# Altium schematic sheet Esquema.SchDoc: ARDU PROTOTYPE.    Gorka G. (part 3 of 3)
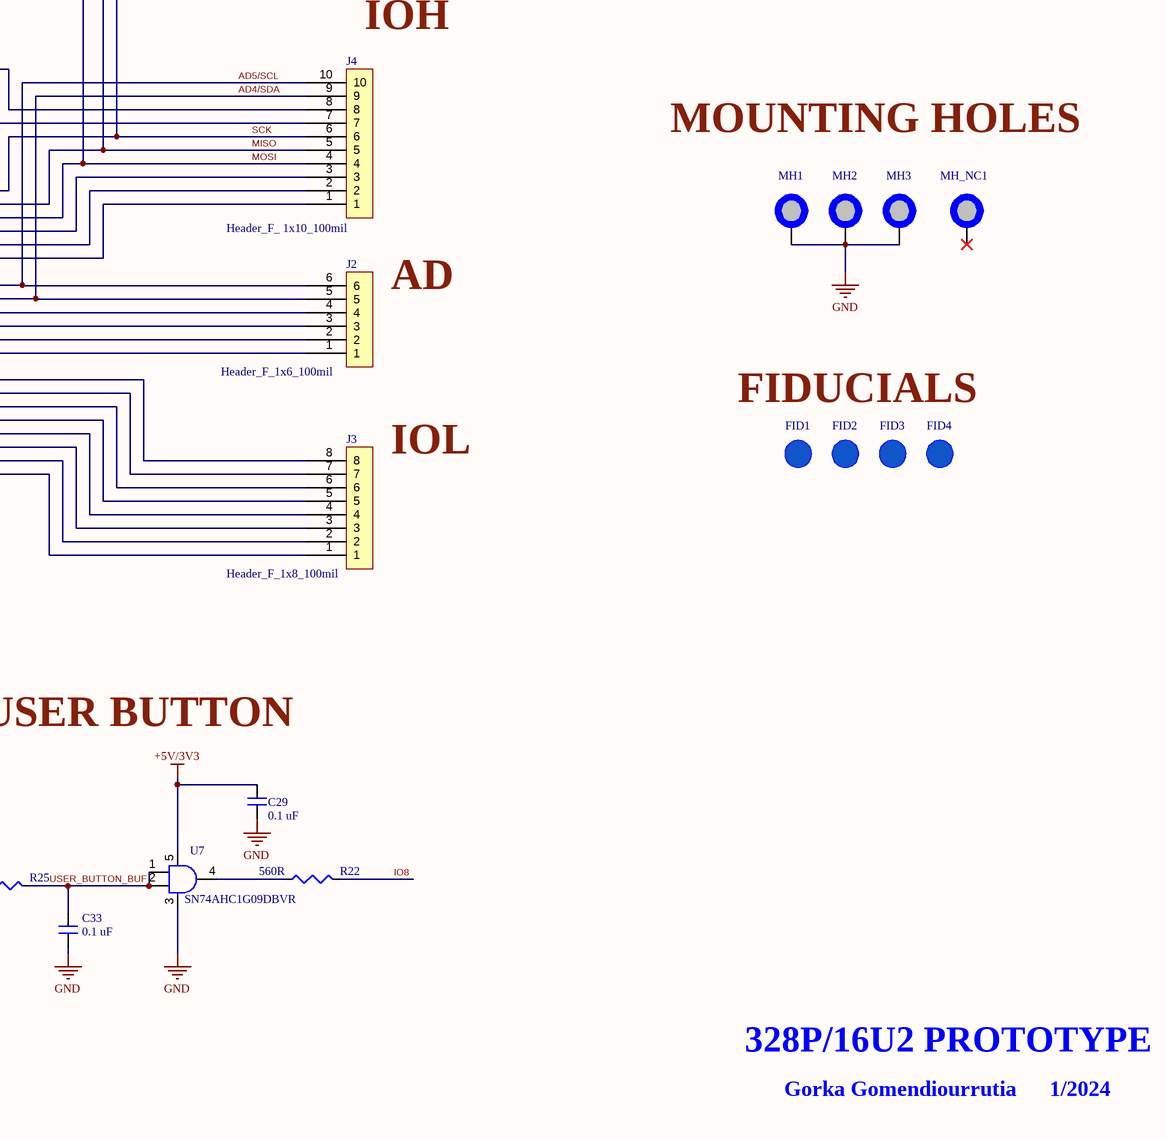
[diagram p5: Esquema.SchDoc, bottom right]

## Library data of the parts (continued)
U3 = TL1963A-33DCQR: LDO Regulator Pos 3.3V 1.5A 6-Pin(5+Tab) SOT-223 T/R; Manufacturer: Texas Instruments; Dropout Voltage: 340mV; Number of Outputs: 1; Max Input Voltage: 20V; Min Input Voltage: 2.1V; Min Current Limit: 1.6A; Input Bias Current: 1mA; Polarity: Positive; Accuracy: 3%; Output Type: Fixed; Supplier 1: Digikey; Manufacturer Part Number: TL1963A-33DCQR; RoHS: Yes; Category: Voltage Regulators - Linear; Stock 1: 9273; Pricing 1: 1=3,45, 10=3,098, 25=2,9292, 100=2,5387, 250=2,40848, 500=2,16114, 1000=1,82265 (USD); Case/Package: SOT-223-6; Number of Pins: 6; Min Operating Temperature: -40°C; Max Operating Temperature: 125°C; Package Quantity: 1; Packaging: Tape and Reel; Output Voltage: 3.3V; Output Current: 1.5A; Max Output Current: 1.5A; Number of Regulators: 1; Quiescent Current: 1mA; Max Output Voltage: 3.3V; Min Output Voltage: 3.3V; Series: -; Radiation Hardening: No; Lead Free: Lead Free; RoHS Compliant: Yes; ComponentLink1URL: https://datasheet.ciiva.com/2046/tl1963a-2046162.pdf?src-supplier=Digikey; ComponentLink1Description: https://datasheet.ciiva.com/2046/tl1963a-2046162.pdf?src-supplier=Digikey; ComponentLink2URL: https://datasheet.ciiva.com/2046/tl1963a-2046161.pdf?src-supplier=Digikey; ComponentLink2Description: https://datasheet.ciiva.com/2046/tl1963a-2046161.pdf?src-supplier=Digikey; ComponentLink3URL: https://datasheet.ciiva.com/2046/tl1963a-2046163.pdf?src-supplier=Digikey; ComponentLink3Description: https://datasheet.ciiva.com/2046/tl1963a-2046163.pdf?src-supplier=Digikey; Supplier Part Number 1: 296-24534-1-ND
U4-U7 = SN74AHC1G09DBVR: 1-ch, 2-input 2-V to 5.5-V high-speed (9 ns) AND gate with open-drain outputs 5-SOT-23 -55 to 125; Manufacturer: Texas Instruments; Min Supply Voltage: 2V; Max Supply Voltage: 5.5V; Quiescent Current: 1uA; Number of Inputs: 2; Propagation Delay: 7.5ns; Output Current: 25mA; Number of Circuits: 1; Low Level Output Current: 8mA; Number of Channels: 1NUMBER; Supplier 1: Digikey; Manufacturer Part Number: SN74AHC1G09DBVR; RoHS: Yes; Category: Logic Gates; Stock 1: 8311; Pricing 1: 1=0,36, 10=0,269, 25=0,2352, 100=0,1522, 250=0,126, 500=0,1008, 1000=0,07729 (USD); Mount: Surface Mount; Case/Package: SOT-23; Number of Pins: 5; Min Operating Temperature: -55°C; Max Operating Temperature: 125°C; Logic Function: AND GATE; Package Quantity: 3000; Packaging: Tape and Reel; Number of Gates: 1; Number of Elements: 1; Number of Bits: 1; Series: 74AHC; Technology: CMOS; Output Voltage: 5.5V; Number of Outputs: 1; Nominal Supply Current: 1uA; Length: 2.9mm; Width: 1.6mm; Height: 1.45mm; Thickness: 1.2mm; Radiation Hardening: No; Reach SVHC Compliant: No; Lead Free: Lead Free; RoHS Compliant: Yes; ComponentLink1URL: https://datasheet.ciiva.com/1864/sn74ahc1g09-1864411.pdf?src-supplier=Digikey; ComponentLink1Description: https://datasheet.ciiva.com/1864/sn74ahc1g09-1864411.pdf?src-supplier=Digikey; ComponentLink2URL: https://datasheet.ciiva.com/1864/sn74ahc1g09-1864410.pdf?src-supplier=Digikey; ComponentLink2Description: https://datasheet.ciiva.com/1864/sn74ahc1g09-1864410.pdf?src-supplier=Digikey; ComponentLink3URL: https://datasheet.ciiva.com/1864/sn74ahc1g09-1864412.pdf?src-supplier=Digikey; ComponentLink3Description: https://datasheet.ciiva.com/1864/sn74ahc1g09-1864412.pdf?src-supplier=Digikey; Supplier Part Number 1: 296-29202-1-ND
Y1 Y2 = ABM7-16.000MHZ-D2Y-T: Crystal 16MHz ±20ppm (Tol) ±30ppm (Stability) 18pF FUND 50Ohm 2-Pin Mini-CSMD T/R; Manufacturer: Abracon; Supplier 1: Digikey; Manufacturer Part Number: ABM7-16.000MHZ-D2Y-T; RoHS: Yes; Category: Crystals; Stock 1: 54717; Pricing 1: 1=0,67, 10=0,556, 50=0,5, 100=0,4444, 500=0,42218 (USD); ComponentLink1URL: https://datasheet.ciiva.com/15116/getdatasheetpartid-721624-15116835.pdf?src-supplier=Verical; ComponentLink1Description: https://datasheet.ciiva.com/15116/getdatasheetpartid-721624-15116835.pdf?src-supplier=Verical; ComponentLink2URL: https://datasheet.ciiva.com/16383/abm7-16383174.pdf?src-supplier=Future+Electronics; ComponentLink2Description: https://datasheet.ciiva.com/16383/abm7-16383174.pdf?src-supplier=Future+Electronics; ComponentLink3URL: https://datasheet.ciiva.com/7998/947971-7998600.pdf?src-supplier=Element14; ComponentLink3Description: https://datasheet.ciiva.com/7998/947971-7998600.pdf?src-supplier=Element14; ComponentLink4URL: https://datasheet.ciiva.com/46385/947971-46385243.pdf?src-supplier=Element14; ComponentLink4Description: https://datasheet.ciiva.com/46385/947971-46385243.pdf?src-supplier=Element14; ComponentLink5URL: https://datasheet.ciiva.com/22658/947971-22658293.pdf?src-supplier=Element14; ComponentLink5Description: https://datasheet.ciiva.com/22658/947971-22658293.pdf?src-supplier=Element14; ComponentLink6URL: https://datasheet.ciiva.com/26941/getdatasheetpartid-719818-26941724.pdf?src-supplier=Verical; ComponentLink6Description: https://datasheet.ciiva.com/26941/getdatasheetpartid-719818-26941724.pdf?src-supplier=Verical; ComponentLink7URL: https://datasheet.ciiva.com/18649/abm7-18649865.pdf?src-supplier=Digikey; ComponentLink7Description: https://datasheet.ciiva.com/18649/abm7-18649865.pdf?src-supplier=Digikey; ComponentLink8URL: https://datasheet.ciiva.com/18649/abm7-18649866.pdf?src-supplier=Digikey; ComponentLink8Description: https://datasheet.ciiva.com/18649/abm7-18649866.pdf?src-supplier=Digikey; ComponentLink9URL: https://datasheet.ciiva.com/18649/abm7-18649867.pdf?src-supplier=Digikey; ComponentLink9Description: https://datasheet.ciiva.com/18649/abm7-18649867.pdf?src-supplier=Digikey; ComponentLink10URL: https://datasheet.ciiva.com/5788/abm7-5788054.pdf?src-supplier=Farnell; ComponentLink10Description: https://datasheet.ciiva.com/5788/abm7-5788054.pdf?src-supplier=Farnell; Supplier Part Number 1: 535-9840-1-ND
Z1 Z2 = CG0603MLC-05E: ESD Suppressor Multilayer Varistor 5V Automotive 2-Pin Case 0603(1608Metric) T/R; Manufacturer: Bourns; Capacitance: 0.5pF; Voltage Rating (AC): 8V; Number of Channels: 1; Clamping Voltage: 20V; Current Rating: 50nA; Supplier 1: Digikey; Manufacturer Part Number: CG0603MLC-05E; RoHS: Yes; Category: Varistors; Stock 1: 173443; Pricing 1: 1=0,45, 10=0,336, 25=0,3032, 100=0,2096, 250=0,17648, 500=0,14338, 1000=0,11029, 2500=0,09926 (USD); Case/Package: 0603; Number of Pins: 2; Case Code (Imperial): 0603; Case Code (Metric): 1608; Contact Plating: Tin; Min Operating Temperature: -40°C; Max Operating Temperature: 85°C; Voltage Rating (DC): 5V; Operating Supply Voltage: 5V; Package Quantity: 1; Packaging: Tape and Reel; Termination: SMD/SMT; Voltage: 5V; Number of Circuits: 1; Max Voltage Rating (DC): 5V; Working Voltage: 5V; Leakage Current: 50nA; Series: MLC; Length: 1.6mm; Width: 0.8mm; Depth: 0.8mm; Thickness: 0.8mm; Radiation Hardening: No; Reach SVHC Compliant: No; RoHS Compliant: Yes; ComponentLink1URL: https://datasheet.ciiva.com/8084/mlc-8084047.pdf?src-supplier=Avnet; ComponentLink1Description: https://datasheet.ciiva.com/8084/mlc-8084047.pdf?src-supplier=Avnet; Supplier Part Number 1: CG0603MLC-05ECT-ND